# Altium schematic sheet 水表通用工装一版.SchDoc
size A4
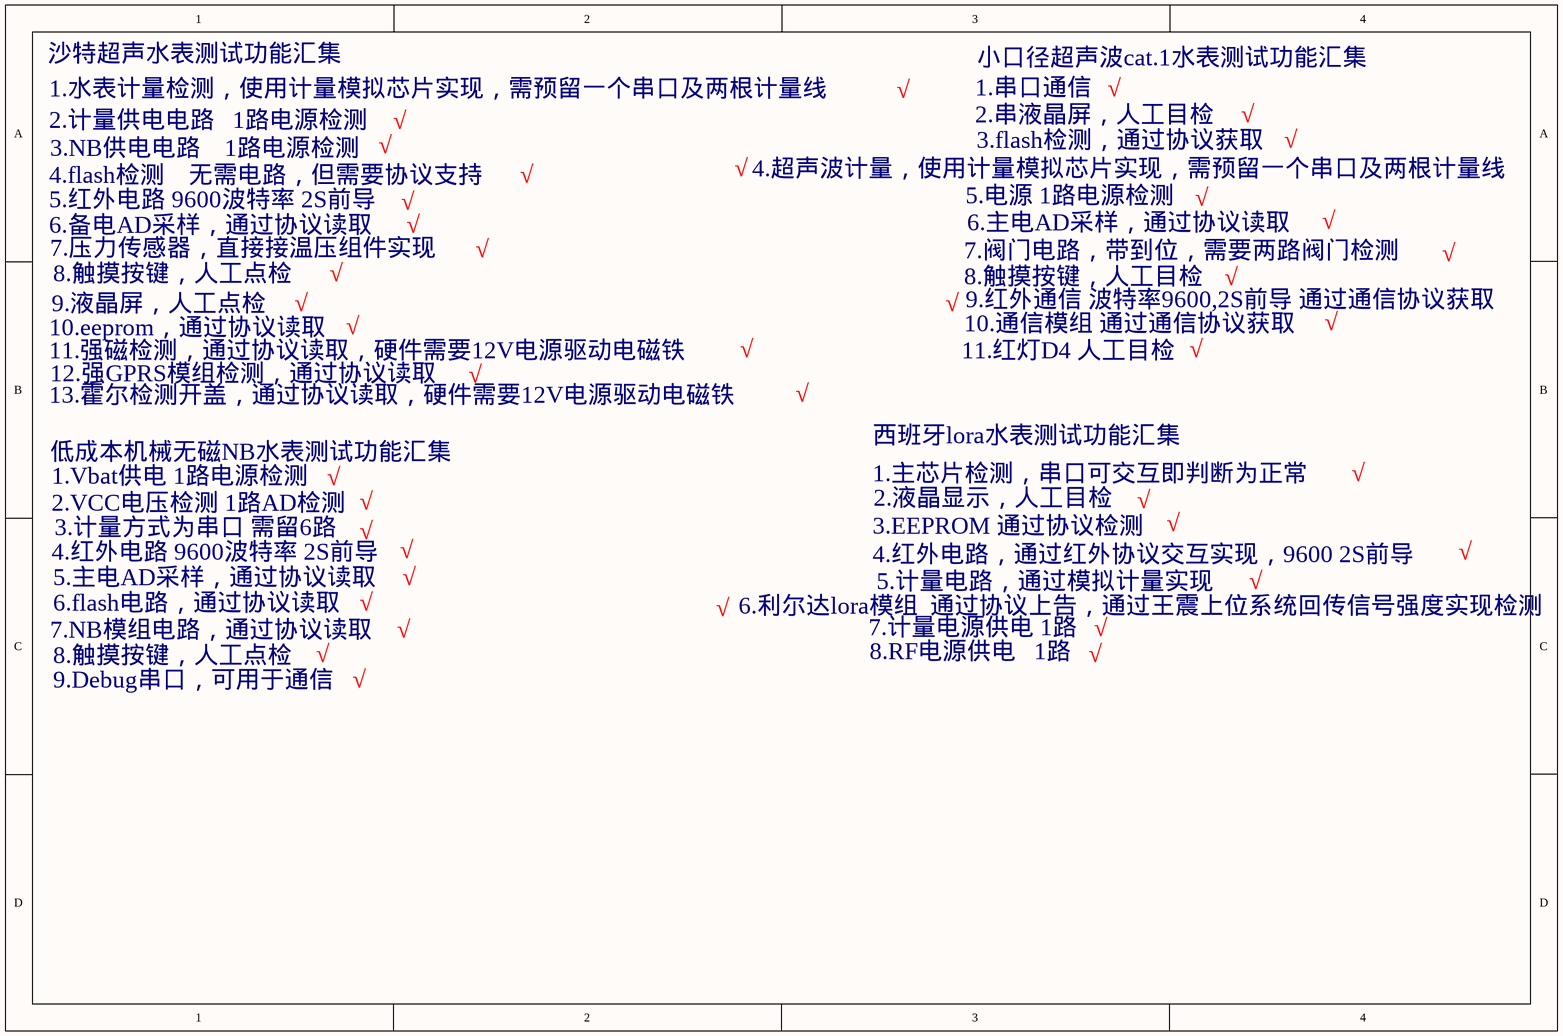
[diagram p0: 水表通用工装一版.SchDoc]

## Notes on the sheet
- 沙特超声水表测试功能汇集
- 1.水表计量检测，使用计量模拟芯片实现，需预留一个串口及两根计量线
- √
- 1.串口通信
- 小口径超声波cat.1水表测试功能汇集
- 2.计量供电电路   1路电源检测
- 3.NB供电电路    1路电源检测
- 4.超声波计量，使用计量模拟芯片实现，需预留一个串口及两根计量线
- 2.串液晶屏，人工目检
- 3.flash检测，通过协议获取
- 4.flash检测    无需电路，但需要协议支持
- 5.红外电路 9600波特率 2S前导
- 6.备电AD采样，通过协议读取
- 5.电源 1路电源检测
- 6.主电AD采样，通过协议读取
- 7.压力传感器，直接接温压组件实现
- 9.液晶屏，人工点检
- 8.触摸按键，人工点检
- 7.阀门电路，带到位，需要两路阀门检测
- 8.触摸按键，人工目检
- 9.红外通信 波特率9600,2S前导 通过通信协议获取
- 10.eeprom，通过协议读取
- 11.强磁检测，通过协议读取，硬件需要12V电源驱动电磁铁
- 12.强GPRS模组检测，通过协议读取
- 11.红灯D4 人工目检
- 10.通信模组 通过通信协议获取
- 13.霍尔检测开盖，通过协议读取，硬件需要12V电源驱动电磁铁
- 西班牙lora水表测试功能汇集
- 低成本机械无磁NB水表测试功能汇集
- 1.Vbat供电 1路电源检测
- 2.VCC电压检测 1路AD检测
- 1.主芯片检测，串口可交互即判断为正常
- 2.液晶显示，人工目检
- 4.红外电路 9600波特率 2S前导
- 3.计量方式为串口 需留6路
- 3.EEPROM 通过协议检测
- 4.红外电路，通过红外协议交互实现，9600 2S前导
- 7.NB模组电路，通过协议读取
- 5.主电AD采样，通过协议读取
- 6.flash电路，通过协议读取
- 6.利尔达lora模组  通过协议上告，通过王震上位系统回传信号强度实现检测
- 7.计量电源供电 1路
- 5.计量电路，通过模拟计量实现
- 9.Debug串口，可用于通信
- 8.RF电源供电   1路